# EAGLE schematic freetserv (EAGLE 7.5.0)

## Sheet 1 of 7
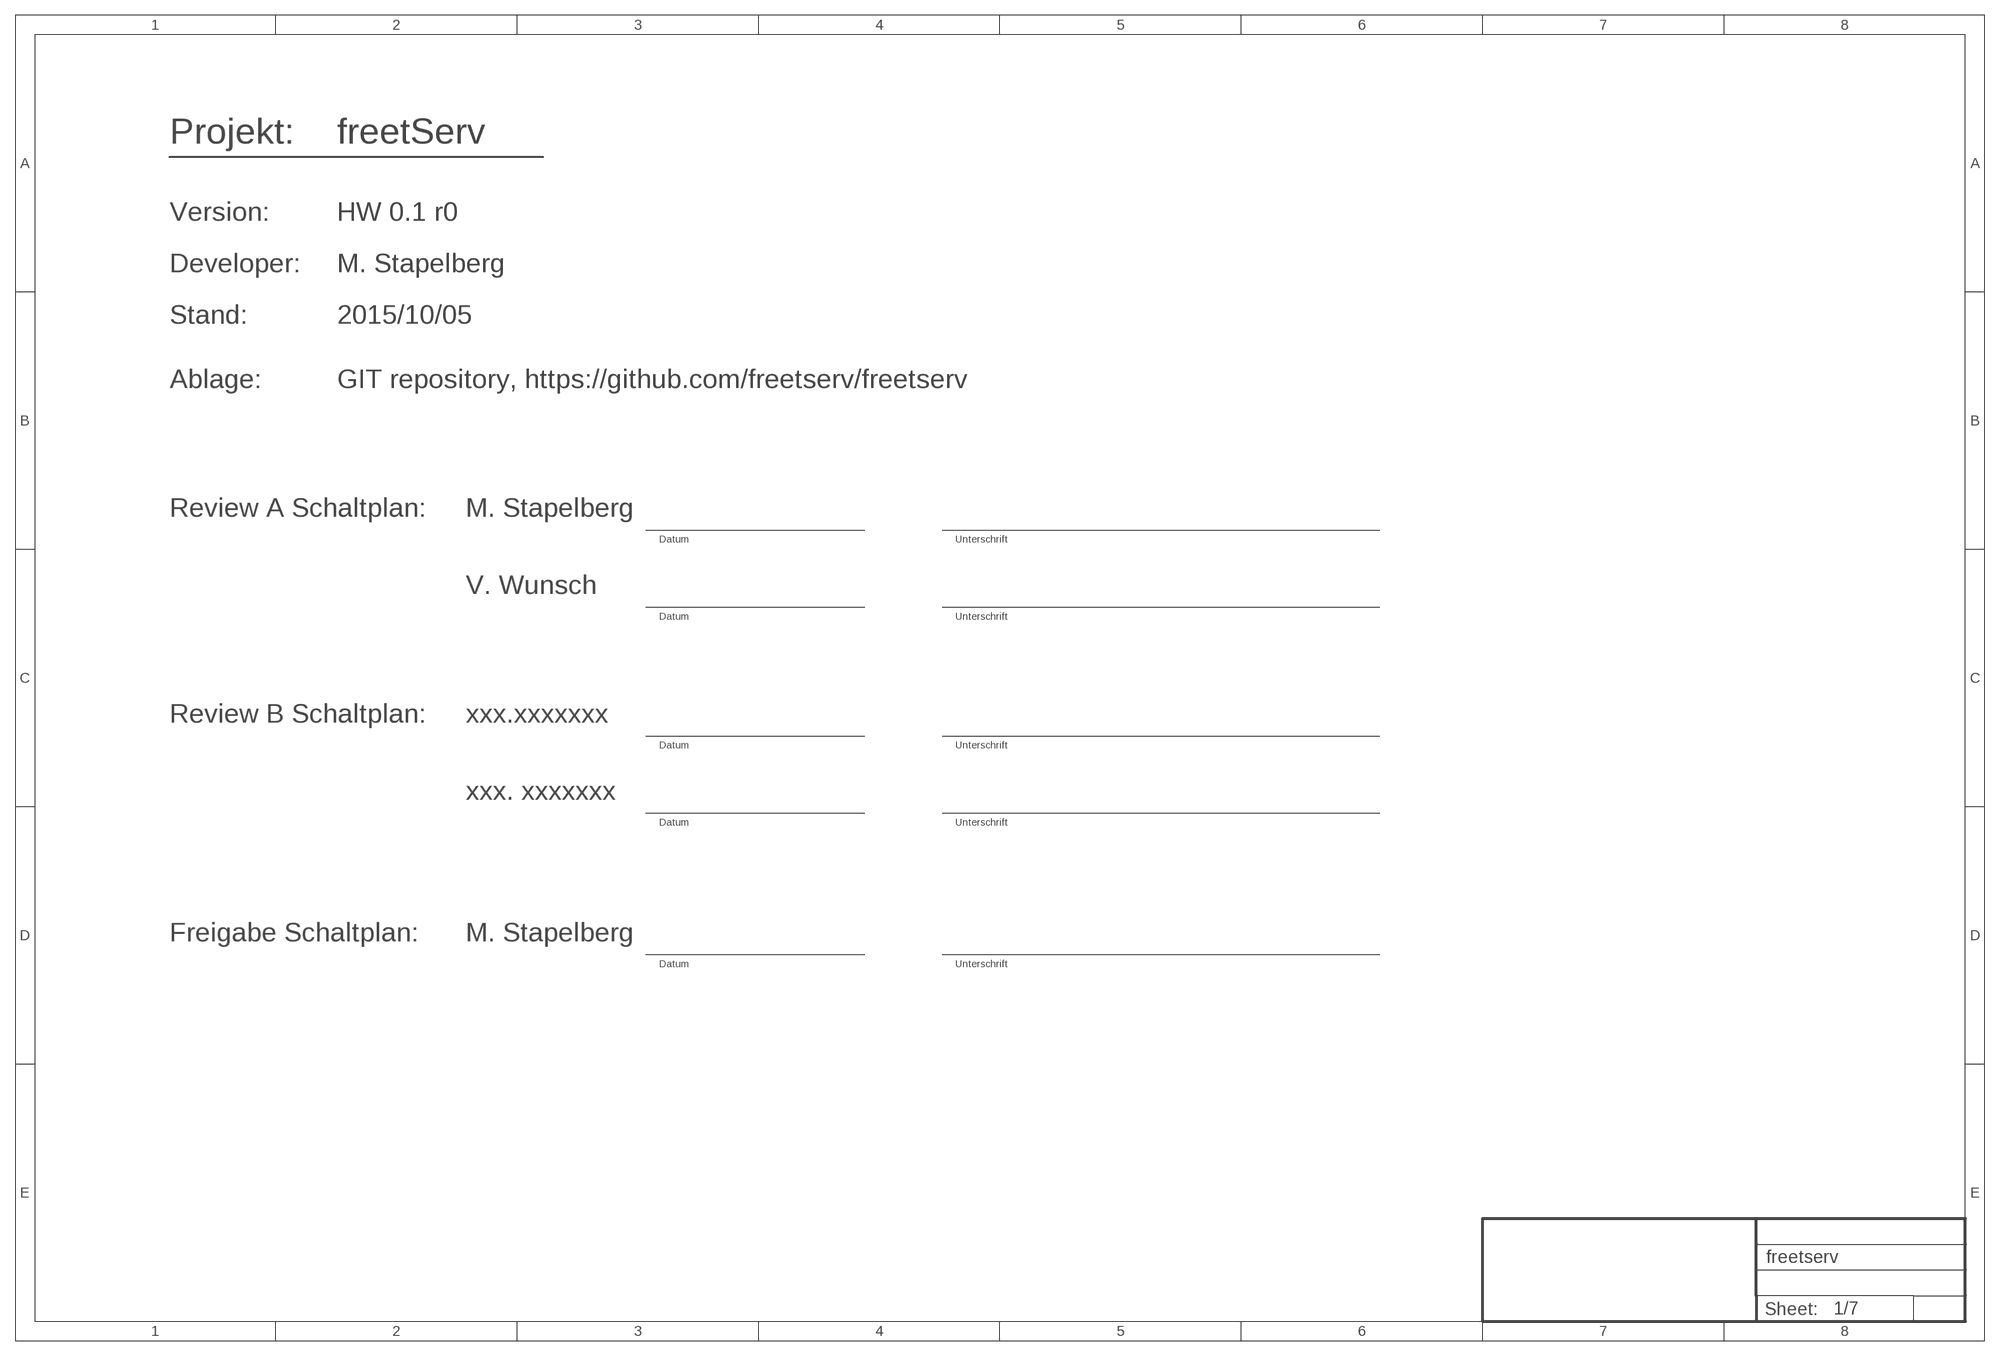
[diagram p0: schematic, sheet 1]

### Notes on the sheet
- Projekt: | freetServ
- Version: | HW 0.1 r0
- Developer: | M. Stapelberg
- Stand: | 2015/10/05
- Ablage: | GIT repository, https://github.com/freetserv/freetserv
- Review A Schaltplan: | M. Stapelberg
- Datum | Unterschrift
- V. Wunsch
- Datum | Unterschrift
- Review B Schaltplan: | xxx.xxxxxxx
- Datum | Unterschrift
- xxx. xxxxxxx
- Datum | Unterschrift
- Freigabe Schaltplan: | M. Stapelberg
- Datum | Unterschrift

## Sheet 2 of 7
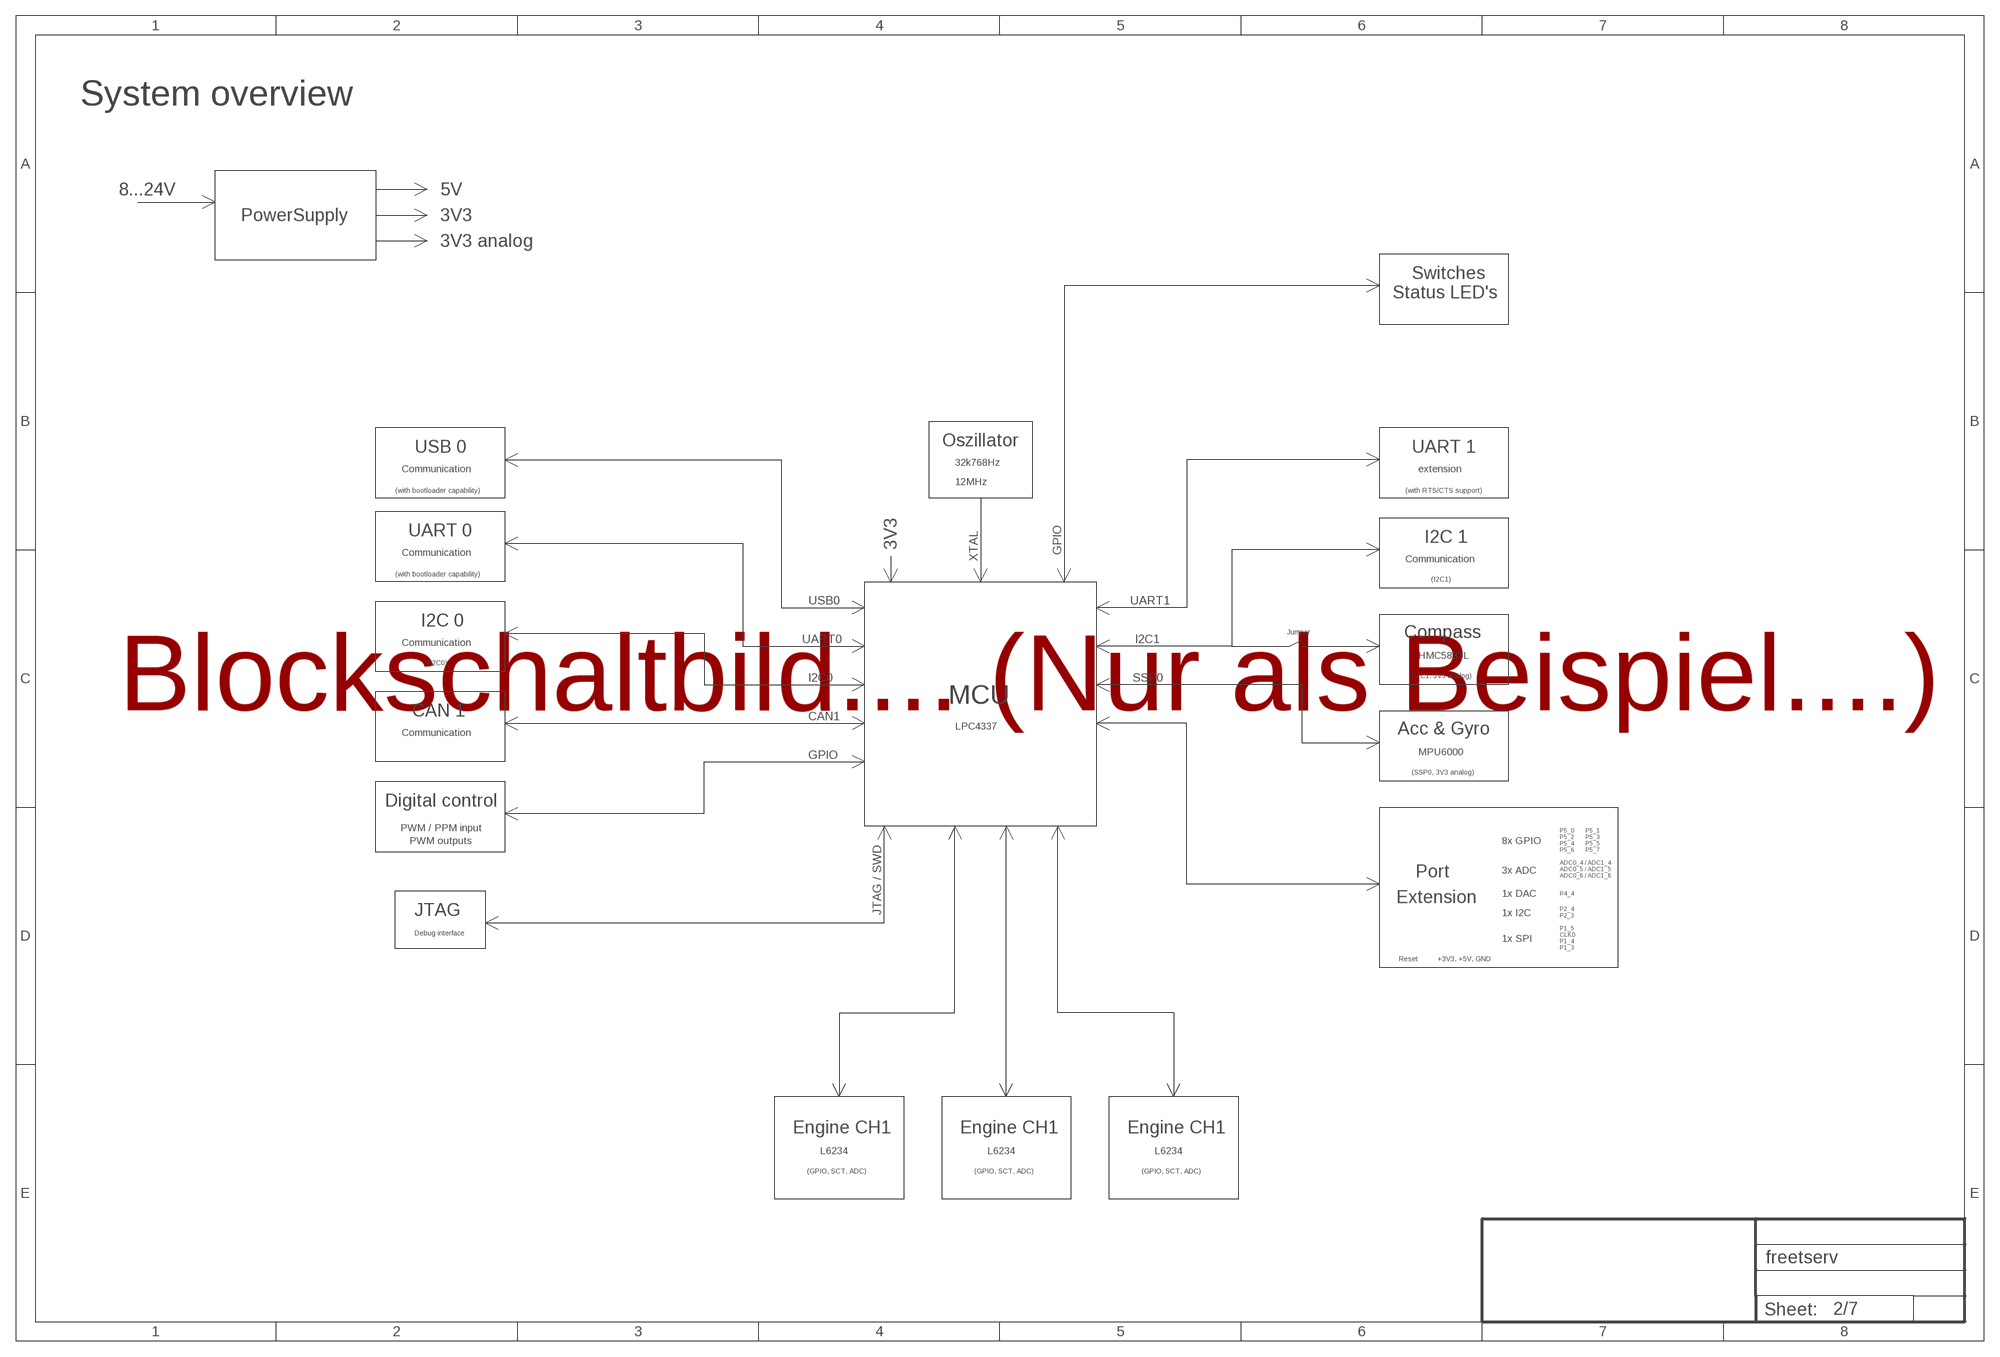
[diagram p1: schematic, sheet 2]

### Notes on the sheet
- System overview
- 8...24V | 5V
- PowerSupply | 3V3
- 3V3 analog
- Switches
- Status LED's
- Oszillator
- USB 0 | UART 1
- 32k768Hz
- Communication | extension
- 12MHz
- (with bootloader capability) | (with RTS/CTS support)
- UART 0
- I2C 1
- 3V3
- Communication | GPIO
- XTAL | Communication
- (with bootloader capability)
- (I2C1)
- USB0 | UART1
- I2C 0
- Jumper
- Compass
- Communication | UART0 | I2C1
- HMC5883L
- (I2C0)
- (I2C1, 3V3 analog)
- I2C0 | SSP0
- Blockschaltbild.... (Nur als Beispiel....) | MCU
- CAN 1
- CAN1
- LPC4337
- Communication | Acc & Gyro
- MPU6000
- GPIO
- (SSP0, 3V3 analog)
- Digital control
- PWM / PPM input | P5_0 | P5_1
- P5_2 | P5_3
- PWM outputs | 8x GPIO | P5_4 | P5_5
- P5_6 | P5_7
- ADC0_4 / ADC1_4
- ADC0_5 / ADC1_5
- 3x ADC
- Port | ADC0_6 / ADC1_6
- 1x DAC | P4_4
- Extension
- P2_4
- JTAG | JTAG / SWD | 1x I2C
- P2_3
- P1_5
- Debug interface | CLK0
- 1x SPI | P1_4
- P1_3
- Reset | +3V3, +5V, GND
- Engine CH1 | Engine CH1 | Engine CH1
- L6234 | L6234 | L6234
- (GPIO, SCT, ADC) | (GPIO, SCT, ADC) | (GPIO, SCT, ADC)

## Sheet 3 of 7
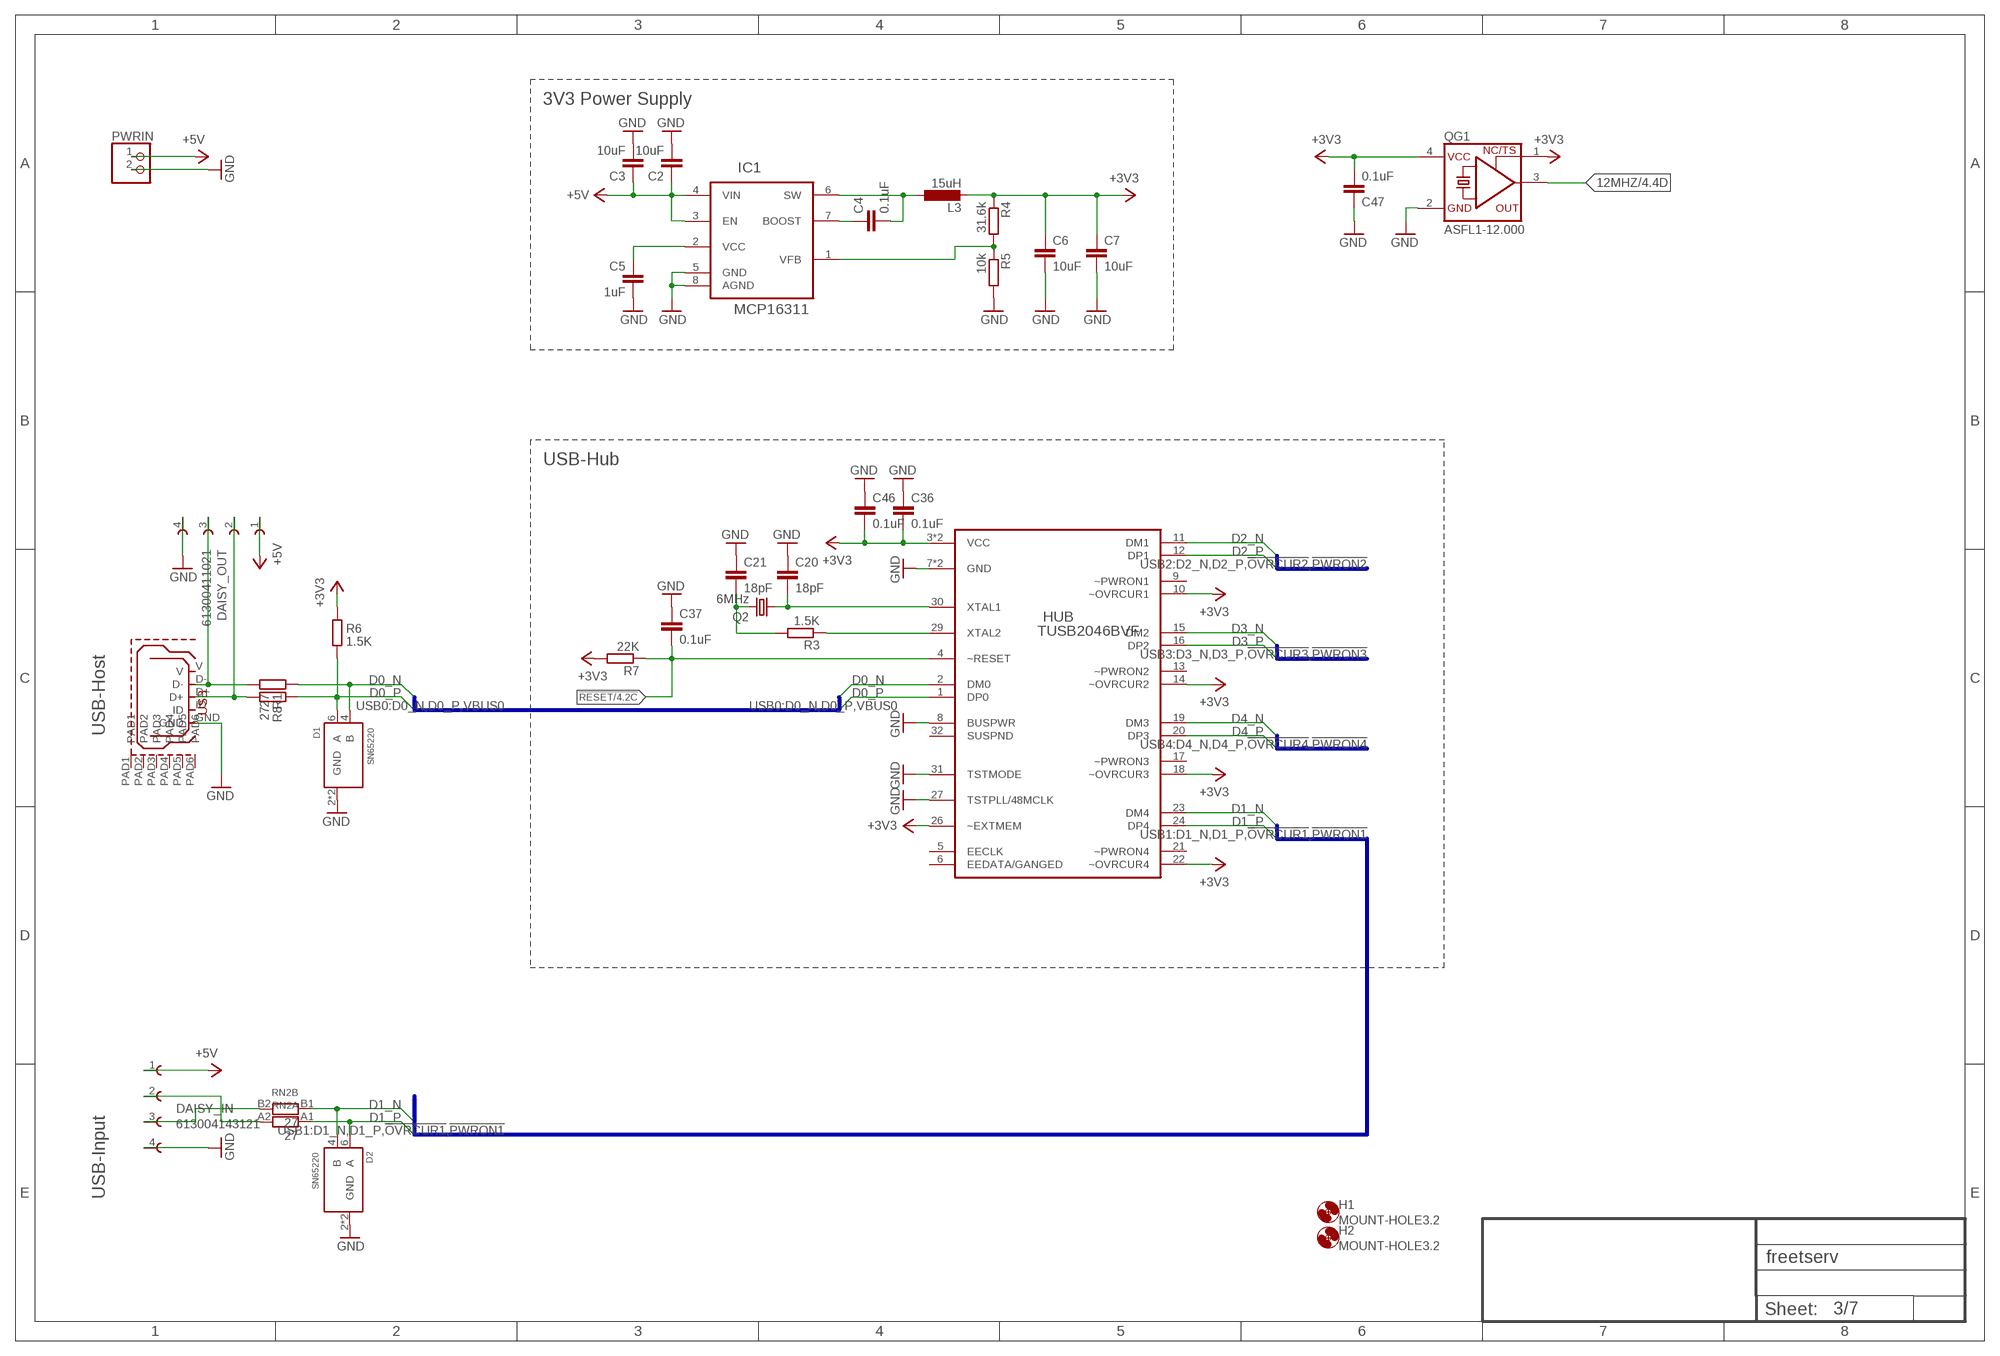
[diagram p2: schematic, sheet 3]

### Parts
C2  10uF  C-EUC0805  [C0805]
C3  10uF  C-EUC0805  [C0805]
C4  0.1uF  C-EUC0805  [C0805]
C5  1uF  C-EUC0805  [C0805]
C6  10uF  C-EUC0805  [C0805]
C7  10uF  C-EUC0805  [C0805]
C20  18pF  C-EUC0805  [C0805]
C21  18pF  C-EUC0805  [C0805]
C36  0.1uF  C-EUC0805  [C0805]
C37  0.1uF  C-EUC0805  [C0805]
C46  0.1uF  C-EUC0805  [C0805]
C47  0.1uF  C-EUC0805  [C0805]
D1  SN65220  [SOT23-6]
D2  SN65220  [SOT23-6]
DAISY_IN  613004143121  [613004143121]
DAISY_OUT  61300411021  [61300411021]
H1  MOUNT-HOLE3.2  [3,2]
H2  MOUNT-HOLE3.2  [3,2]
HUB  TUSB2046BVF  [QFP80P900X900X145-32N]
IC1  MCP16311  MCP16311-E/MS  [MSOP8]
L3  15uH  NR6028T220M  [NR60XX]
PWRIN  PINHD-1X2  [1X02]
Q2  6MHz  CSM-7X-DU  [CSM-7X-DU]
QG1  ASFL1-12.000  XO-XO53  [XO53]
R1  27  R-EU_R0805  [R0805]
R3  1.5K  R-EU_R0805  [R0805]
R4  31.6k  R-EU_R0805  [R0805]
R5  10k  R-EU_R0805  [R0805]
R6  1.5K  R-EU_R0805  [R0805]
R7  22K  R-EU_R0805  [R0805]
R8  27  R-EU_R0805  [R0805]
RN2  27  EXBV4V  [EXBV4V]
USB_HOST  USB_MICROB  [USB_MICROB_PACKAGE]

### Nets
12MHZ: QG1.3(OUT) ; also sheet 4,5,6
!RESET: C37.2 HUB.4(~RESET) R7.1 ; also sheet 4,5,6
+3V3 [power]: C6.1 C7.1 C36.2 C46.2 C47.2 HUB.3(VCC) HUB.10(~OVRCUR1) HUB.14(~OVRCUR2) HUB.18(~OVRCUR3) HUB.22(~OVRCUR4) HUB.25(VCC) HUB.26(~EXTMEM) L3.2 QG1.1(TS) QG1.4(VCC) R4.1 R6.1 R7.2 ; also sheet 4,5,6
+5V [power]: C2.1 C3.1 DAISY_IN.1 DAISY_OUT.1 IC1.3(EN) IC1.4(VIN) PWRIN.1
D0_N [USB]: D1.4(B) HUB.2(DM0) R1.1
D0_P [USB]: D1.6(A) HUB.1(DP0) R6.2 R8.1
D1_N [USB]: D2.4(B) HUB.23(DM4) RN2.B1
D1_P [USB]: D2.6(A) HUB.24(DP4) RN2.A1
D2_N [USB]: HUB.11(DM1) ; also sheet 4
D2_P [USB]: HUB.12(DP1) ; also sheet 4
D3_N [USB]: HUB.15(DM2) ; also sheet 5
D3_P [USB]: HUB.16(DP2) ; also sheet 5
D4_N [USB]: HUB.19(DM3) ; also sheet 6
D4_P [USB]: HUB.20(DP3) ; also sheet 6
DX0_N [USB]: DAISY_OUT.3 R1.2 USB_HOST.D-
DX0_P [USB]: DAISY_OUT.2 R8.2 USB_HOST.D+
GND: C2.2 C3.2 C5.2 C6.2 C7.2 C20.1 C21.1 C36.1 C37.1 C46.1 C47.1 D1.2(GND) D1.5(GND) D2.2(GND) D2.5(GND) DAISY_IN.4 DAISY_OUT.4 HUB.7(GND) HUB.8(BUSPWR) HUB.27(TSTPLL/48MCLK) HUB.28(GND) HUB.31(TSTMODE) IC1.5(GND) IC1.8(AGND) PWRIN.2 QG1.2(GND) R5.2 USB_HOST.GND ; also sheet 4,5,6
N$3: C4.1 IC1.7(BOOST)
N$4: C4.2 IC1.6(SW) L3.1
N$6: IC1.1(VFB) R4.2 R5.1
N$7: DAISY_IN.2 RN2.A2
N$8: DAISY_IN.3 RN2.B2
N$10: C5.1 IC1.2(VCC)
N$37: HUB.29(XTAL2) R3.1
N$44: C20.2 HUB.30(XTAL1) Q2.1
N$45: C21.2 Q2.2 R3.2
Unconnected: HUB.5(EECLK) HUB.6(EEDATA/GANGED) HUB.9(~PWRON1) HUB.13(~PWRON2) HUB.17(~PWRON3) HUB.21(~PWRON4) HUB.32(SUSPND) USB_HOST.ID USB_HOST.PAD1 USB_HOST.PAD2 USB_HOST.PAD3 USB_HOST.PAD4 USB_HOST.PAD5 USB_HOST.PAD6 USB_HOST.V

### Buses
USB1:D1_N,D1_P,!OVRCUR1,!PWRON1
USB2:D2_N,D2_P,!OVRCUR2,!PWRON2
USB3:D3_N,D3_P,!OVRCUR3,!PWRON3
USB4:D4_N,D4_P,!OVRCUR4,!PWRON4
USB0:D0_N,D0_P,VBUS0

### Notes on the sheet
- 3V3 Power Supply
- USB-Hub
- USB-Host
- USB-Input

## Sheet 4 of 7
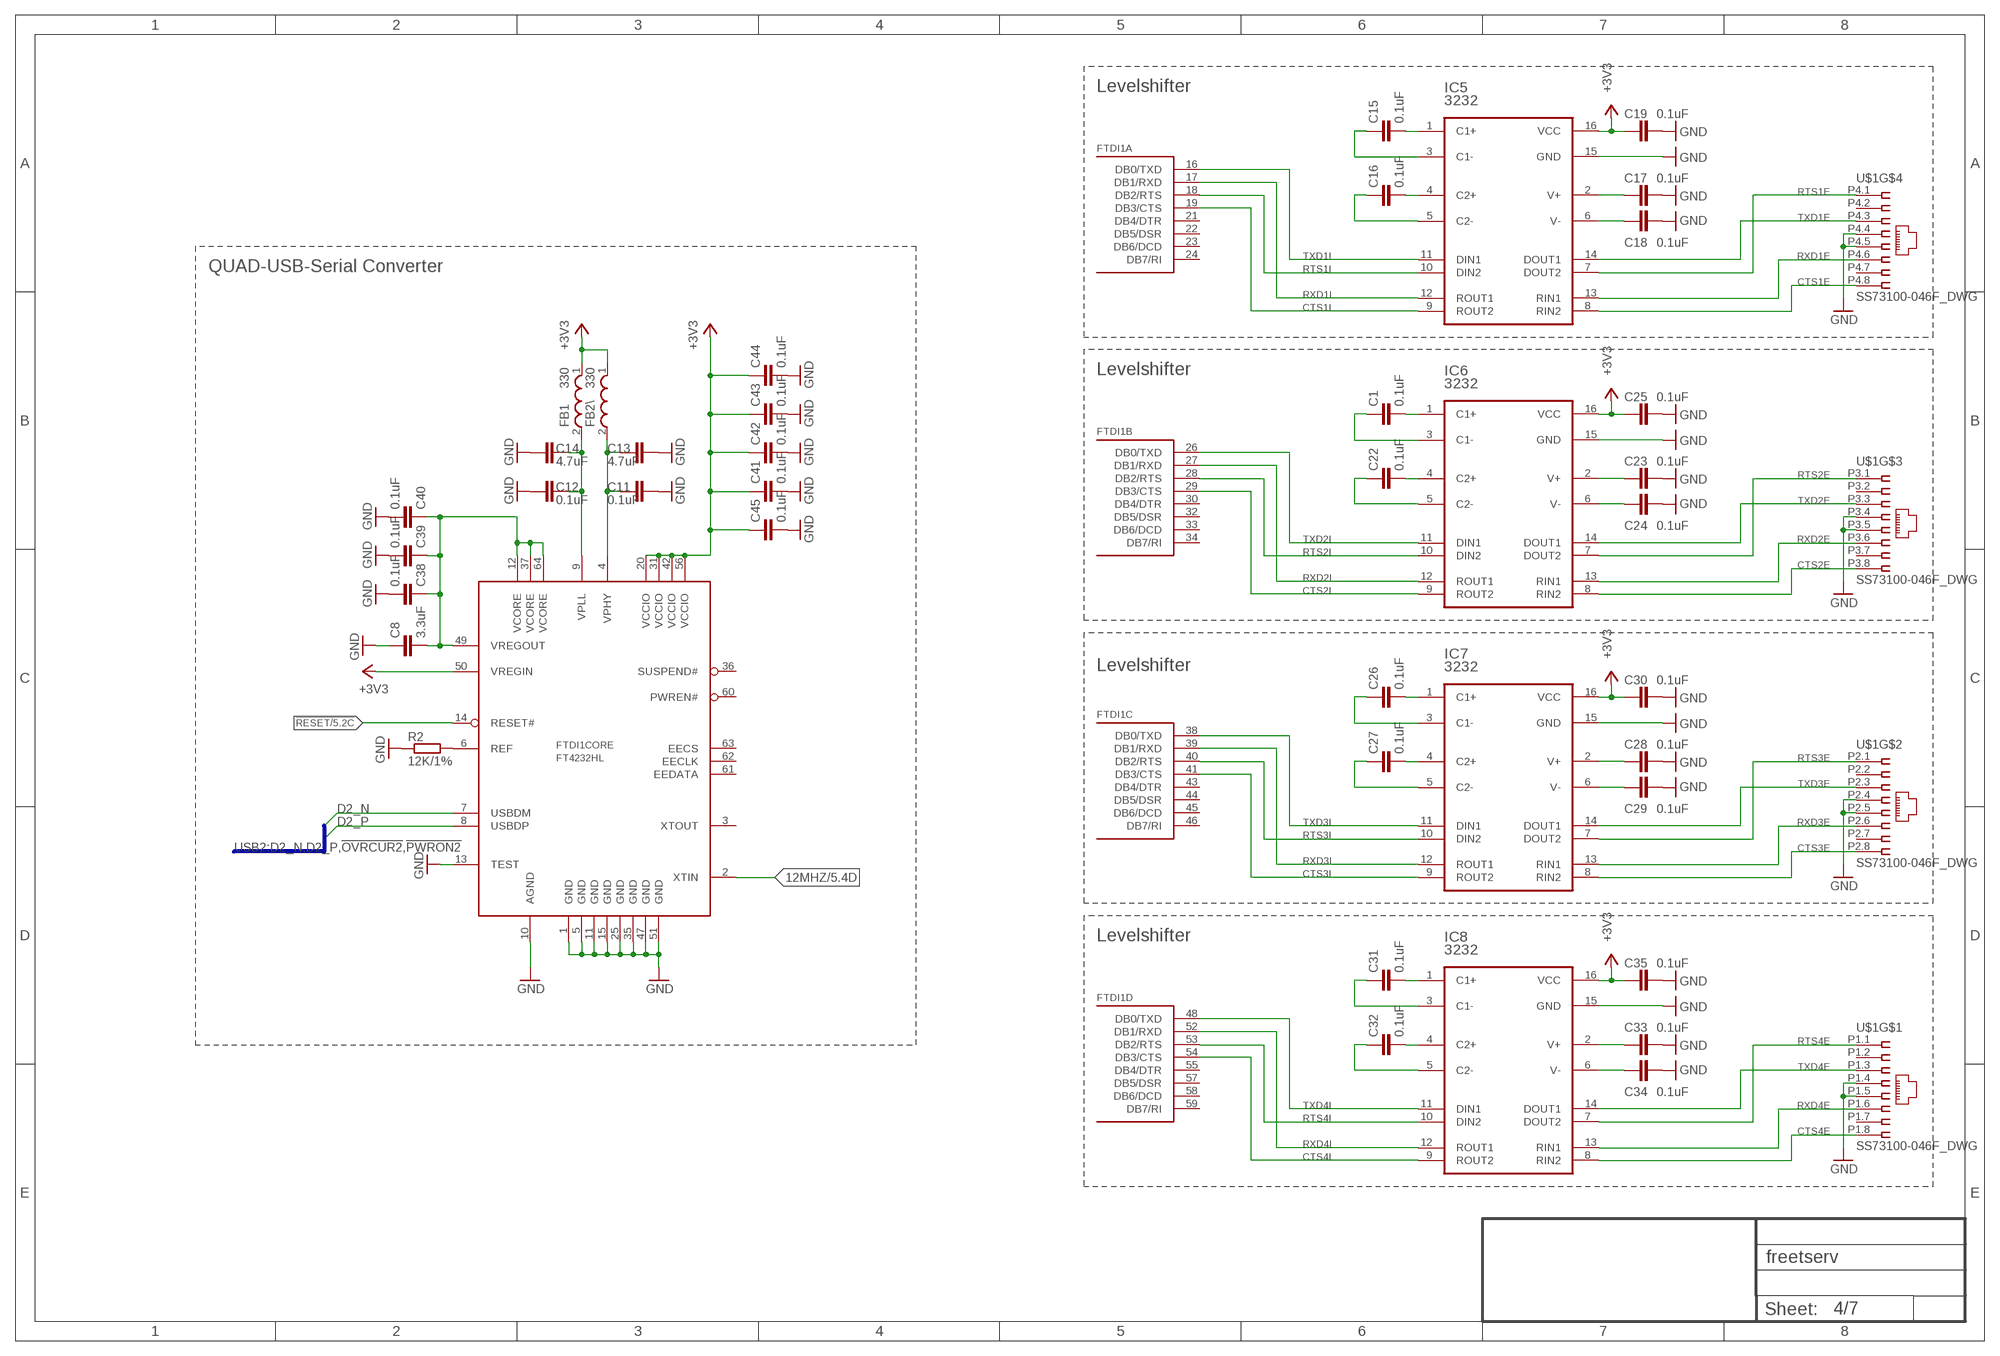
[diagram p3: schematic, sheet 4]

### Parts
C1  0.1uF  C-EUC0805  [C0805]
C8  3.3uF  C-EUC0805  [C0805]
C11  0.1uF  C-EUC0805  [C0805]
C12  0.1uF  C-EUC0805  [C0805]
C13  4.7uF  C-EUC0805  [C0805]
C14  4.7uF  C-EUC0805  [C0805]
C15  0.1uF  C-EUC0805  [C0805]
C16  0.1uF  C-EUC0805  [C0805]
C17  0.1uF  C-EUC0805  [C0805]
C18  0.1uF  C-EUC0805  [C0805]
C19  0.1uF  C-EUC0805  [C0805]
C22  0.1uF  C-EUC0805  [C0805]
C23  0.1uF  C-EUC0805  [C0805]
C24  0.1uF  C-EUC0805  [C0805]
C25  0.1uF  C-EUC0805  [C0805]
C26  0.1uF  C-EUC0805  [C0805]
C27  0.1uF  C-EUC0805  [C0805]
C28  0.1uF  C-EUC0805  [C0805]
C29  0.1uF  C-EUC0805  [C0805]
C30  0.1uF  C-EUC0805  [C0805]
C31  0.1uF  C-EUC0805  [C0805]
C32  0.1uF  C-EUC0805  [C0805]
C33  0.1uF  C-EUC0805  [C0805]
C34  0.1uF  C-EUC0805  [C0805]
C35  0.1uF  C-EUC0805  [C0805]
C38  0.1uF  C-EUC0805  [C0805]
C39  0.1uF  C-EUC0805  [C0805]
C40  0.1uF  C-EUC0805  [C0805]
C41  0.1uF  C-EUC0805  [C0805]
C42  0.1uF  C-EUC0805  [C0805]
C43  0.1uF  C-EUC0805  [C0805]
C44  0.1uF  C-EUC0805  [C0805]
C45  0.1uF  C-EUC0805  [C0805]
FB1  330  WE-KI_0805A  [WE-KI_0805A]
FB2\  330  WE-KI_0805A  [WE-KI_0805A]
FTDI1  FT4232HL  [LQFP64]
IC5  3232  MAX3232ECPW  [SOP65P640X120-16N]
IC6  3232  MAX3232ECPW  [SOP65P640X120-16N]
IC7  3232  MAX3232ECPW  [SOP65P640X120-16N]
IC8  3232  MAX3232ECPW  [SOP65P640X120-16N]
R2  12K/1%  R-EU_R0805  [R0805]
U$1  SS73100-046F_DWG  [SS73100-046F]

### Nets
12MHZ: FTDI1.2(CORE:XTIN) ; also sheet 3,5,6
!RESET: FTDI1.14(CORE:RESET#) ; also sheet 3,5,6
+1V8-1: C8.2 C38.1 C39.1 C40.1 FTDI1.12(CORE:VCORE) FTDI1.37(CORE:VCORE) FTDI1.49(CORE:VREGOUT) FTDI1.64(CORE:VCORE)
+3V3 [power]: C19.2 C25.2 C30.2 C35.2 C41.1 C42.1 C43.1 C44.1 C45.1 FB1.1 FB2\.1 FTDI1.20(CORE:VCCIO) FTDI1.31(CORE:VCCIO) FTDI1.42(CORE:VCCIO) FTDI1.50(CORE:VREGIN) FTDI1.56(CORE:VCCIO) IC5.16(VCC) IC6.16(VCC) IC7.16(VCC) IC8.16(VCC) ; also sheet 3,5,6
CTS1E: IC5.8(RIN2) U$1.P4.8
CTS1I: FTDI1.19(A:DB3/CTS) IC5.9(ROUT2)
CTS2E: IC6.8(RIN2) U$1.P3.8
CTS2I: FTDI1.29(B:DB3/CTS) IC6.9(ROUT2)
CTS3E: IC7.8(RIN2) U$1.P2.8
CTS3I: FTDI1.41(C:DB3/CTS) IC7.9(ROUT2)
CTS4E: IC8.8(RIN2) U$1.P1.8
CTS4I: FTDI1.54(D:DB3/CTS) IC8.9(ROUT2)
D2_N [USB]: FTDI1.7(CORE:USBDM) ; also sheet 3
D2_P [USB]: FTDI1.8(CORE:USBDP) ; also sheet 3
GND: C8.1 C11.2 C12.2 C13.2 C14.2 C17.1 C18.1 C19.1 C23.1 C24.1 C25.1 C28.1 C29.1 C30.1 C33.1 C34.1 C35.1 C38.2 C39.2 C40.2 C41.2 C42.2 C43.2 C44.2 C45.2 FTDI1.1(CORE:GND) FTDI1.5(CORE:GND) FTDI1.10(CORE:AGND) FTDI1.11(CORE:GND) FTDI1.13(CORE:TEST) FTDI1.15(CORE:GND) FTDI1.25(CORE:GND) FTDI1.35(CORE:GND) FTDI1.47(CORE:GND) FTDI1.51(CORE:GND) IC5.15(GND) IC6.15(GND) IC7.15(GND) IC8.15(GND) R2.1 U$1.P1.4 U$1.P1.5 U$1.P2.4 U$1.P2.5 U$1.P3.4 U$1.P3.5 U$1.P4.4 U$1.P4.5 ; also sheet 3,5,6
N$1: C1.2 IC6.1(C1+)
N$2: C1.1 IC6.3(C1-)
N$11: C22.2 IC6.4(C2+)
N$12: C22.1 IC6.5(C2-)
N$14: FTDI1.6(CORE:REF) R2.2
N$17: C11.1 C13.1 FB2\.2 FTDI1.4(CORE:VPHY)
N$18: C12.1 C14.1 FB1.2 FTDI1.9(CORE:VPLL)
N$21: C23.2 IC6.2(V+)
N$22: C24.2 IC6.6(V-)
N$31: C15.2 IC5.1(C1+)
N$32: C15.1 IC5.3(C1-)
N$33: C16.2 IC5.4(C2+)
N$34: C16.1 IC5.5(C2-)
N$39: C17.2 IC5.2(V+)
N$40: C18.2 IC5.6(V-)
N$46: C26.2 IC7.1(C1+)
N$47: C26.1 IC7.3(C1-)
N$48: C27.2 IC7.4(C2+)
N$49: C27.1 IC7.5(C2-)
N$52: C28.2 IC7.2(V+)
N$53: C29.2 IC7.6(V-)
N$60: C31.2 IC8.1(C1+)
N$61: C31.1 IC8.3(C1-)
N$62: C32.2 IC8.4(C2+)
N$63: C32.1 IC8.5(C2-)
N$66: C33.2 IC8.2(V+)
N$67: C34.2 IC8.6(V-)
RTS1E: IC5.7(DOUT2) U$1.P4.1
RTS1I: FTDI1.18(A:DB2/RTS) IC5.10(DIN2)
RTS2E: IC6.7(DOUT2) U$1.P3.1
RTS2I: FTDI1.28(B:DB2/RTS) IC6.10(DIN2)
RTS3E: IC7.7(DOUT2) U$1.P2.1
RTS3I: FTDI1.40(C:DB2/RTS) IC7.10(DIN2)
RTS4E: IC8.7(DOUT2) U$1.P1.1
RTS4I: FTDI1.53(D:DB2/RTS) IC8.10(DIN2)
RXD1E: IC5.13(RIN1) U$1.P4.6
RXD1I: FTDI1.17(A:DB1/RXD) IC5.12(ROUT1)
RXD2E: IC6.13(RIN1) U$1.P3.6
RXD2I: FTDI1.27(B:DB1/RXD) IC6.12(ROUT1)
RXD3E: IC7.13(RIN1) U$1.P2.6
RXD3I: FTDI1.39(C:DB1/RXD) IC7.12(ROUT1)
RXD4E: IC8.13(RIN1) U$1.P1.6
RXD4I: FTDI1.52(D:DB1/RXD) IC8.12(ROUT1)
TXD1E: IC5.14(DOUT1) U$1.P4.3
TXD1I: FTDI1.16(A:DB0/TXD) IC5.11(DIN1)
TXD2E: IC6.14(DOUT1) U$1.P3.3
TXD2I: FTDI1.26(B:DB0/TXD) IC6.11(DIN1)
TXD3E: IC7.14(DOUT1) U$1.P2.3
TXD3I: FTDI1.38(C:DB0/TXD) IC7.11(DIN1)
TXD4E: IC8.14(DOUT1) U$1.P1.3
TXD4I: FTDI1.48(D:DB0/TXD) IC8.11(DIN1)
Unconnected: FTDI1.3(CORE:XTOUT) FTDI1.21(A:DB4/DTR) FTDI1.22(A:DB5/DSR) FTDI1.23(A:DB6/DCD) FTDI1.24(A:DB7/RI) FTDI1.30(B:DB4/DTR) FTDI1.32(B:DB5/DSR) FTDI1.33(B:DB6/DCD) FTDI1.34(B:DB7/RI) FTDI1.36(CORE:SUSPEND#) FTDI1.43(C:DB4/DTR) FTDI1.44(C:DB5/DSR) FTDI1.45(C:DB6/DCD) FTDI1.46(C:DB7/RI) FTDI1.55(D:DB4/DTR) FTDI1.57(D:DB5/DSR) FTDI1.58(D:DB6/DCD) FTDI1.59(D:DB7/RI) FTDI1.60(CORE:PWREN#) FTDI1.61(CORE:EEDATA) FTDI1.62(CORE:EECLK) FTDI1.63(CORE:EECS) U$1.H1 U$1.H2 U$1.H3 U$1.H4 U$1.H5 U$1.H6 U$1.H7 U$1.H8 U$1.H9 U$1.P1.2 U$1.P1.7 U$1.P2.2 U$1.P2.7 U$1.P3.2 U$1.P3.7 U$1.P4.2 U$1.P4.7

### Buses
USB2:D2_N,D2_P,!OVRCUR2,!PWRON2

### Notes on the sheet
- Levelshifter
- QUAD-USB-Serial Converter
- Levelshifter
- Levelshifter
- Levelshifter

## Sheet 5 of 7
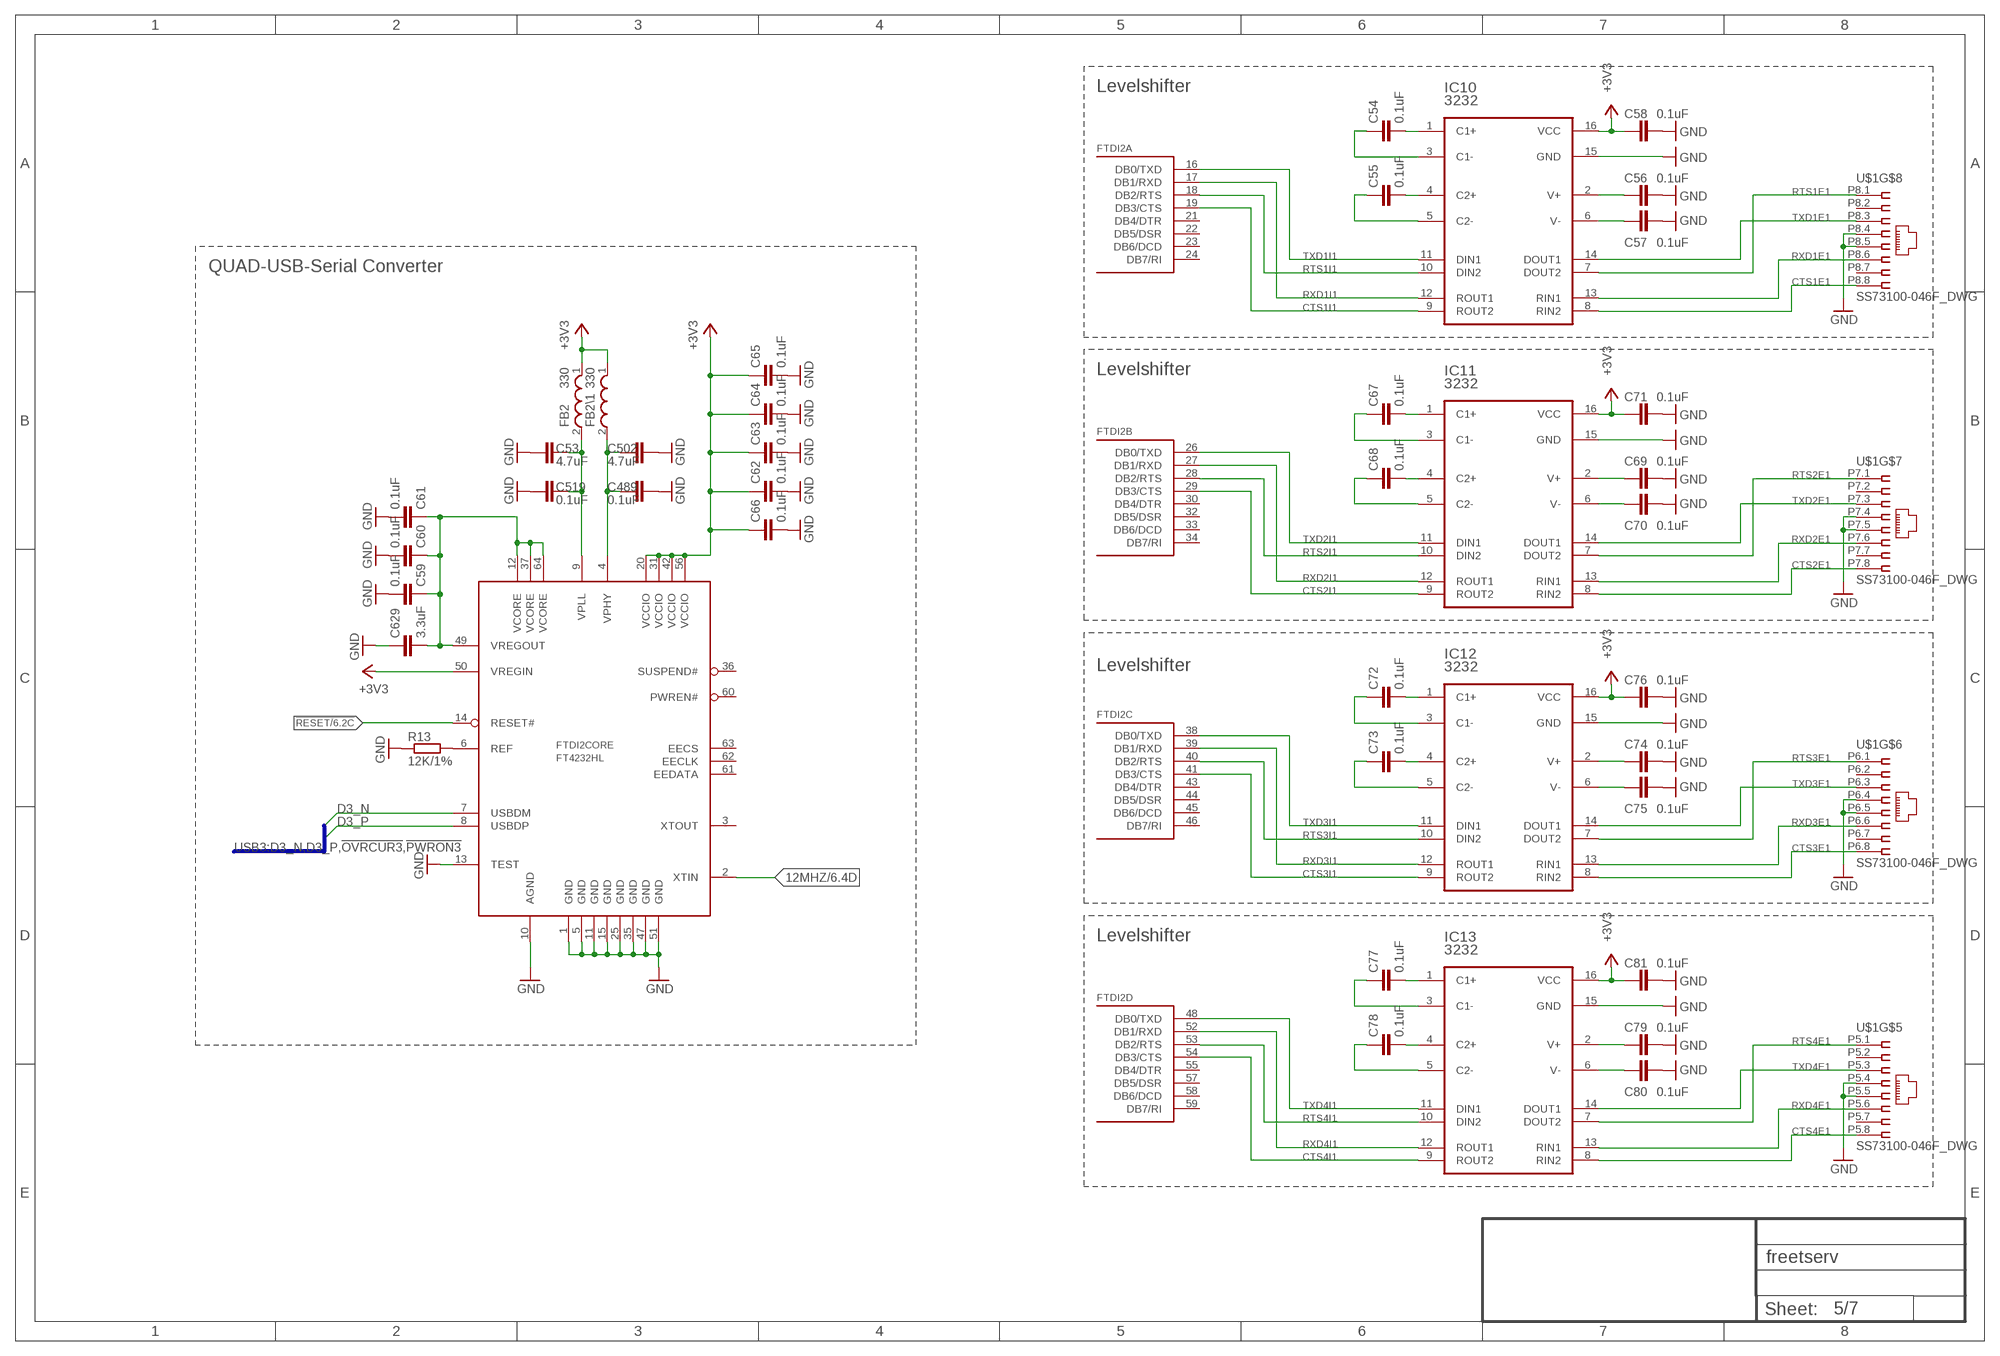
[diagram p4: schematic, sheet 5]

### Parts
C53  4.7uF  C-EUC0805  [C0805]
C54  0.1uF  C-EUC0805  [C0805]
C55  0.1uF  C-EUC0805  [C0805]
C56  0.1uF  C-EUC0805  [C0805]
C57  0.1uF  C-EUC0805  [C0805]
C58  0.1uF  C-EUC0805  [C0805]
C59  0.1uF  C-EUC0805  [C0805]
C60  0.1uF  C-EUC0805  [C0805]
C61  0.1uF  C-EUC0805  [C0805]
C62  0.1uF  C-EUC0805  [C0805]
C63  0.1uF  C-EUC0805  [C0805]
C64  0.1uF  C-EUC0805  [C0805]
C65  0.1uF  C-EUC0805  [C0805]
C66  0.1uF  C-EUC0805  [C0805]
C67  0.1uF  C-EUC0805  [C0805]
C68  0.1uF  C-EUC0805  [C0805]
C69  0.1uF  C-EUC0805  [C0805]
C70  0.1uF  C-EUC0805  [C0805]
C71  0.1uF  C-EUC0805  [C0805]
C72  0.1uF  C-EUC0805  [C0805]
C73  0.1uF  C-EUC0805  [C0805]
C74  0.1uF  C-EUC0805  [C0805]
C75  0.1uF  C-EUC0805  [C0805]
C76  0.1uF  C-EUC0805  [C0805]
C77  0.1uF  C-EUC0805  [C0805]
C78  0.1uF  C-EUC0805  [C0805]
C79  0.1uF  C-EUC0805  [C0805]
C80  0.1uF  C-EUC0805  [C0805]
C81  0.1uF  C-EUC0805  [C0805]
C489  0.1uF  C-EUC0805  [C0805]
C502  4.7uF  C-EUC0805  [C0805]
C519  0.1uF  C-EUC0805  [C0805]
C629  3.3uF  C-EUC0805  [C0805]
FB2  330  WE-KI_0805A  [WE-KI_0805A]
FB2\1  330  WE-KI_0805A  [WE-KI_0805A]
FTDI2  FT4232HL  [LQFP64]
IC10  3232  MAX3232ECPW  [SOP65P640X120-16N]
IC11  3232  MAX3232ECPW  [SOP65P640X120-16N]
IC12  3232  MAX3232ECPW  [SOP65P640X120-16N]
IC13  3232  MAX3232ECPW  [SOP65P640X120-16N]
R13  12K/1%  R-EU_R0805  [R0805]

### Nets
12MHZ: FTDI2.2(CORE:XTIN) ; also sheet 3,4,6
!RESET: FTDI2.14(CORE:RESET#) ; also sheet 3,4,6
+1V8-2: C59.1 C60.1 C61.1 C629.2 FTDI2.12(CORE:VCORE) FTDI2.37(CORE:VCORE) FTDI2.49(CORE:VREGOUT) FTDI2.64(CORE:VCORE)
+3V3 [power]: C58.2 C62.1 C63.1 C64.1 C65.1 C66.1 C71.2 C76.2 C81.2 FB2.1 FB2\1.1 FTDI2.20(CORE:VCCIO) FTDI2.31(CORE:VCCIO) FTDI2.42(CORE:VCCIO) FTDI2.50(CORE:VREGIN) FTDI2.56(CORE:VCCIO) IC10.16(VCC) IC11.16(VCC) IC12.16(VCC) IC13.16(VCC) ; also sheet 3,4,6
CTS1E1: IC10.8(RIN2) U$1.P8.8
CTS1I1: FTDI2.19(A:DB3/CTS) IC10.9(ROUT2)
CTS2E1: IC11.8(RIN2) U$1.P7.8
CTS2I1: FTDI2.29(B:DB3/CTS) IC11.9(ROUT2)
CTS3E1: IC12.8(RIN2) U$1.P6.8
CTS3I1: FTDI2.41(C:DB3/CTS) IC12.9(ROUT2)
CTS4E1: IC13.8(RIN2) U$1.P5.8
CTS4I1: FTDI2.54(D:DB3/CTS) IC13.9(ROUT2)
D3_N [USB]: FTDI2.7(CORE:USBDM) ; also sheet 3
D3_P [USB]: FTDI2.8(CORE:USBDP) ; also sheet 3
GND: C53.2 C56.1 C57.1 C58.1 C59.2 C60.2 C61.2 C62.2 C63.2 C64.2 C65.2 C66.2 C69.1 C70.1 C71.1 C74.1 C75.1 C76.1 C79.1 C80.1 C81.1 C489.2 C502.2 C519.2 C629.1 FTDI2.1(CORE:GND) FTDI2.5(CORE:GND) FTDI2.10(CORE:AGND) FTDI2.11(CORE:GND) FTDI2.13(CORE:TEST) FTDI2.15(CORE:GND) FTDI2.25(CORE:GND) FTDI2.35(CORE:GND) FTDI2.47(CORE:GND) FTDI2.51(CORE:GND) IC10.15(GND) IC11.15(GND) IC12.15(GND) IC13.15(GND) R13.1 U$1.P5.4 U$1.P5.5 U$1.P6.4 U$1.P6.5 U$1.P7.4 U$1.P7.5 U$1.P8.4 U$1.P8.5 ; also sheet 3,4,6
N$5: FTDI2.6(CORE:REF) R13.2
N$19: C54.2 IC10.1(C1+)
N$20: C54.1 IC10.3(C1-)
N$23: C55.2 IC10.4(C2+)
N$24: C55.1 IC10.5(C2-)
N$25: C56.2 IC10.2(V+)
N$26: C57.2 IC10.6(V-)
N$27: C67.2 IC11.1(C1+)
N$28: C67.1 IC11.3(C1-)
N$29: C68.2 IC11.4(C2+)
N$30: C68.1 IC11.5(C2-)
N$35: C69.2 IC11.2(V+)
N$36: C70.2 IC11.6(V-)
N$38: C72.2 IC12.1(C1+)
N$41: C72.1 IC12.3(C1-)
N$42: C73.2 IC12.4(C2+)
N$43: C73.1 IC12.5(C2-)
N$50: C74.2 IC12.2(V+)
N$51: C75.2 IC12.6(V-)
N$55: C77.1 IC13.3(C1-)
N$56: C78.2 IC13.4(C2+)
N$57: C78.1 IC13.5(C2-)
N$58: C79.2 IC13.2(V+)
N$59: C80.2 IC13.6(V-)
N$555: C489.1 C502.1 FB2\1.2 FTDI2.4(CORE:VPHY)
N$1355: C53.1 C519.1 FB2.2 FTDI2.9(CORE:VPLL)
N$5499: C77.2 IC13.1(C1+)
RTS1E1: IC10.7(DOUT2) U$1.P8.1
RTS1I1: FTDI2.18(A:DB2/RTS) IC10.10(DIN2)
RTS2E1: IC11.7(DOUT2) U$1.P7.1
RTS2I1: FTDI2.28(B:DB2/RTS) IC11.10(DIN2)
RTS3E1: IC12.7(DOUT2) U$1.P6.1
RTS3I1: FTDI2.40(C:DB2/RTS) IC12.10(DIN2)
RTS4E1: IC13.7(DOUT2) U$1.P5.1
RTS4I1: FTDI2.53(D:DB2/RTS) IC13.10(DIN2)
RXD1E1: IC10.13(RIN1) U$1.P8.6
RXD1I1: FTDI2.17(A:DB1/RXD) IC10.12(ROUT1)
RXD2E1: IC11.13(RIN1) U$1.P7.6
RXD2I1: FTDI2.27(B:DB1/RXD) IC11.12(ROUT1)
RXD3E1: IC12.13(RIN1) U$1.P6.6
RXD3I1: FTDI2.39(C:DB1/RXD) IC12.12(ROUT1)
RXD4E1: IC13.13(RIN1) U$1.P5.6
RXD4I1: FTDI2.52(D:DB1/RXD) IC13.12(ROUT1)
TXD1E1: IC10.14(DOUT1) U$1.P8.3
TXD1I1: FTDI2.16(A:DB0/TXD) IC10.11(DIN1)
TXD2E1: IC11.14(DOUT1) U$1.P7.3
TXD2I1: FTDI2.26(B:DB0/TXD) IC11.11(DIN1)
TXD3E1: IC12.14(DOUT1) U$1.P6.3
TXD3I1: FTDI2.38(C:DB0/TXD) IC12.11(DIN1)
TXD4E1: IC13.14(DOUT1) U$1.P5.3
TXD4I1: FTDI2.48(D:DB0/TXD) IC13.11(DIN1)
Unconnected: FTDI2.3(CORE:XTOUT) FTDI2.21(A:DB4/DTR) FTDI2.22(A:DB5/DSR) FTDI2.23(A:DB6/DCD) FTDI2.24(A:DB7/RI) FTDI2.30(B:DB4/DTR) FTDI2.32(B:DB5/DSR) FTDI2.33(B:DB6/DCD) FTDI2.34(B:DB7/RI) FTDI2.36(CORE:SUSPEND#) FTDI2.43(C:DB4/DTR) FTDI2.44(C:DB5/DSR) FTDI2.45(C:DB6/DCD) FTDI2.46(C:DB7/RI) FTDI2.55(D:DB4/DTR) FTDI2.57(D:DB5/DSR) FTDI2.58(D:DB6/DCD) FTDI2.59(D:DB7/RI) FTDI2.60(CORE:PWREN#) FTDI2.61(CORE:EEDATA) FTDI2.62(CORE:EECLK) FTDI2.63(CORE:EECS) U$1.P5.2 U$1.P5.7 U$1.P6.2 U$1.P6.7 U$1.P7.2 U$1.P7.7 U$1.P8.2 U$1.P8.7

### Buses
USB3:D3_N,D3_P,!OVRCUR3,!PWRON3

### Notes on the sheet
- Levelshifter
- QUAD-USB-Serial Converter
- Levelshifter
- Levelshifter
- Levelshifter

## Sheet 6 of 7
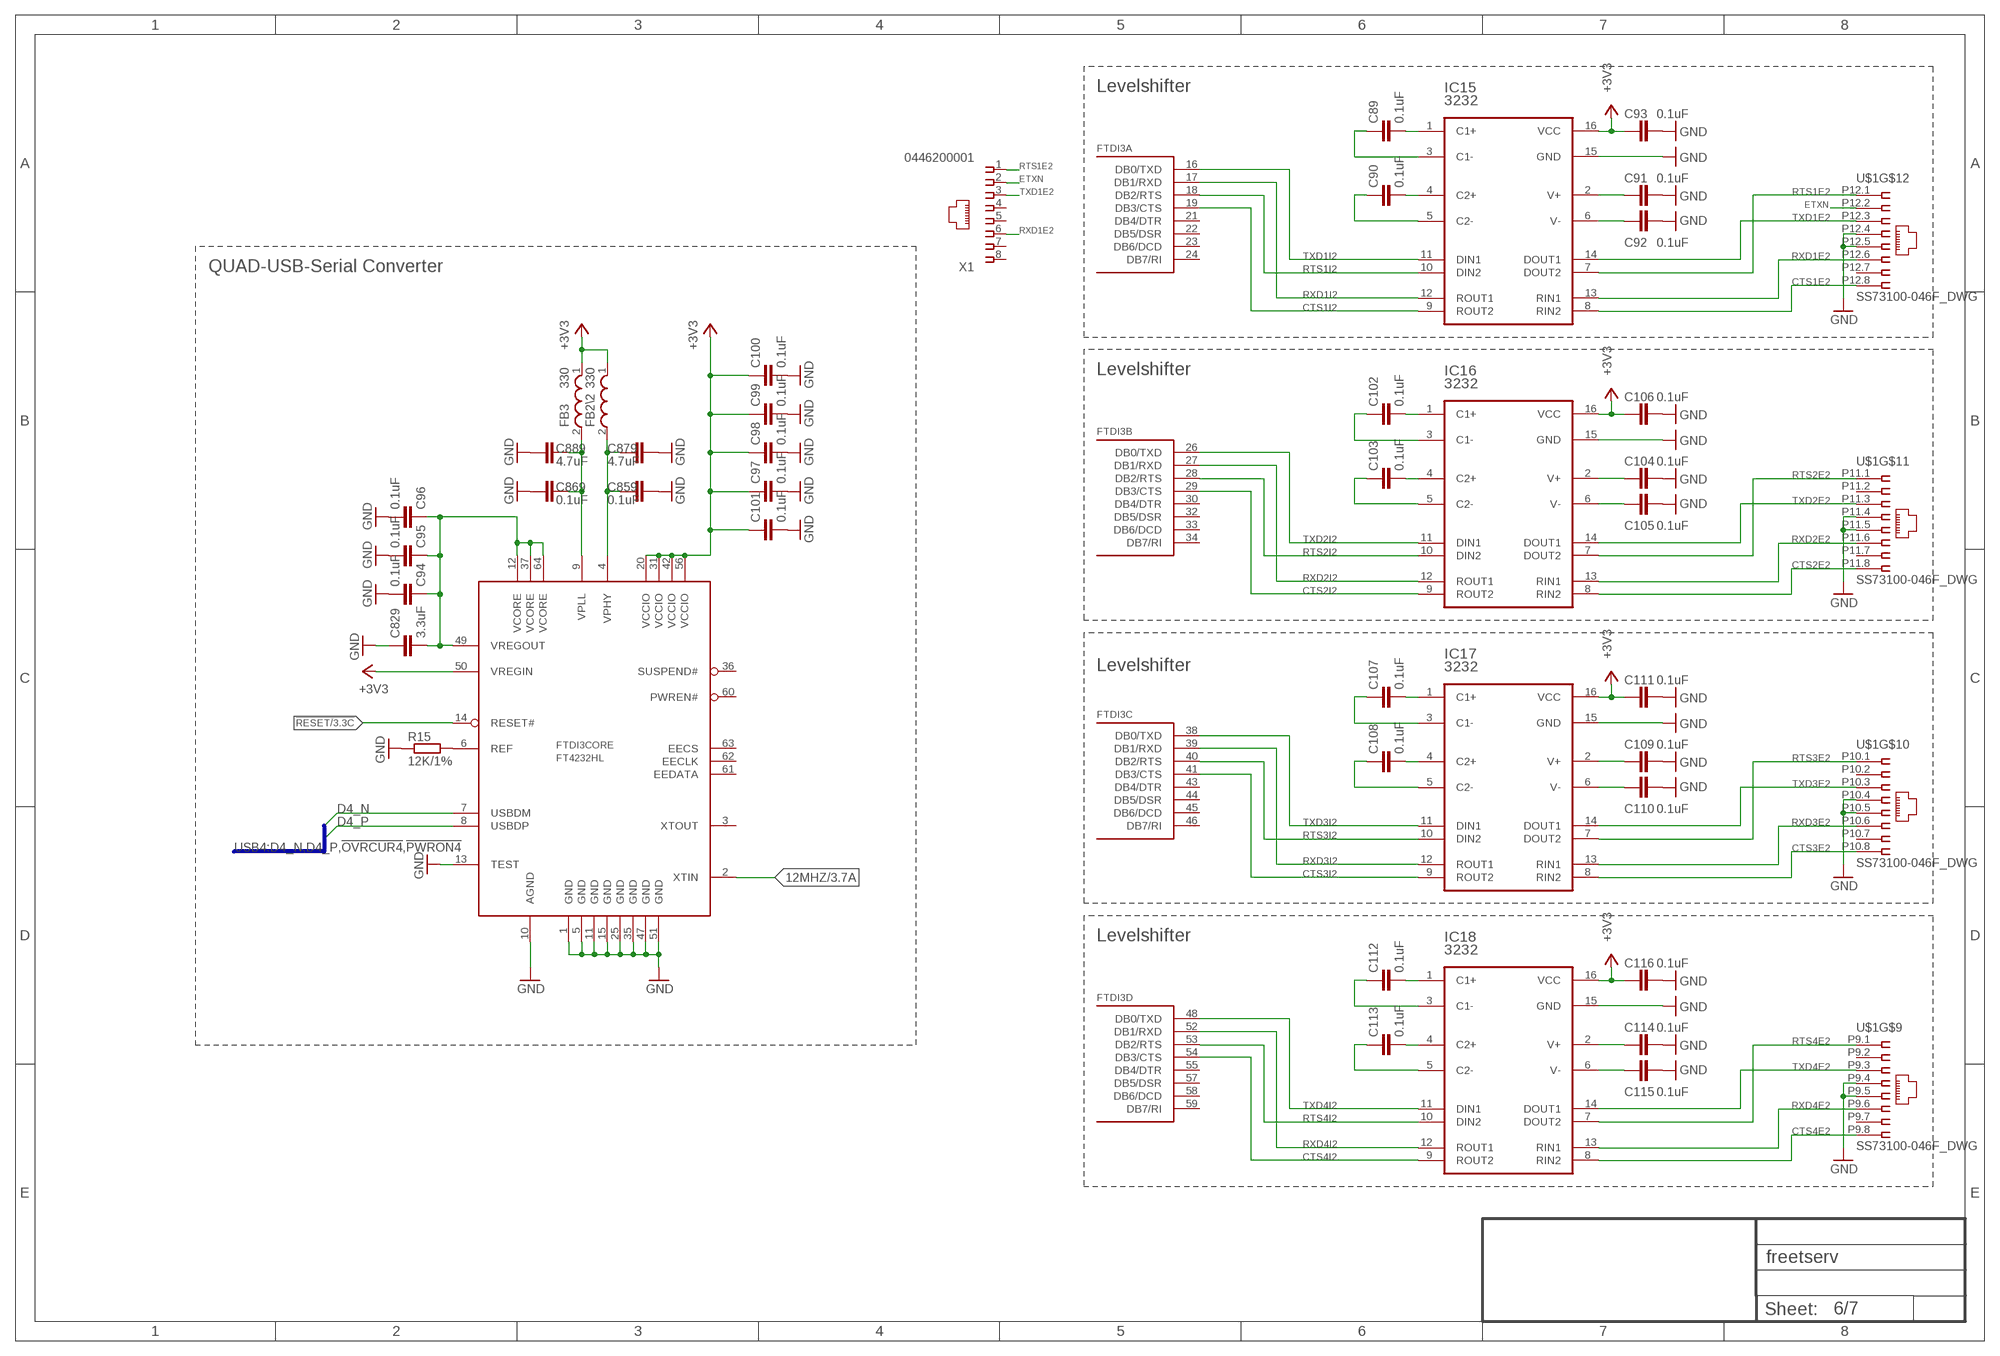
[diagram p5: schematic, sheet 6]

### Parts
C89  0.1uF  C-EUC0805  [C0805]
C90  0.1uF  C-EUC0805  [C0805]
C91  0.1uF  C-EUC0805  [C0805]
C92  0.1uF  C-EUC0805  [C0805]
C93  0.1uF  C-EUC0805  [C0805]
C94  0.1uF  C-EUC0805  [C0805]
C95  0.1uF  C-EUC0805  [C0805]
C96  0.1uF  C-EUC0805  [C0805]
C97  0.1uF  C-EUC0805  [C0805]
C98  0.1uF  C-EUC0805  [C0805]
C99  0.1uF  C-EUC0805  [C0805]
C100  0.1uF  C-EUC0805  [C0805]
C101  0.1uF  C-EUC0805  [C0805]
C102  0.1uF  C-EUC0805  [C0805]
C103  0.1uF  C-EUC0805  [C0805]
C104  0.1uF  C-EUC0805  [C0805]
C105  0.1uF  C-EUC0805  [C0805]
C106  0.1uF  C-EUC0805  [C0805]
C107  0.1uF  C-EUC0805  [C0805]
C108  0.1uF  C-EUC0805  [C0805]
C109  0.1uF  C-EUC0805  [C0805]
C110  0.1uF  C-EUC0805  [C0805]
C111  0.1uF  C-EUC0805  [C0805]
C112  0.1uF  C-EUC0805  [C0805]
C113  0.1uF  C-EUC0805  [C0805]
C114  0.1uF  C-EUC0805  [C0805]
C115  0.1uF  C-EUC0805  [C0805]
C116  0.1uF  C-EUC0805  [C0805]
C829  3.3uF  C-EUC0805  [C0805]
C859  0.1uF  C-EUC0805  [C0805]
C869  0.1uF  C-EUC0805  [C0805]
C879  4.7uF  C-EUC0805  [C0805]
C889  4.7uF  C-EUC0805  [C0805]
FB2\2  330  WE-KI_0805A  [WE-KI_0805A]
FB3  330  WE-KI_0805A  [WE-KI_0805A]
FTDI3  FT4232HL  [LQFP64]
IC15  3232  MAX3232ECPW  [SOP65P640X120-16N]
IC16  3232  MAX3232ECPW  [SOP65P640X120-16N]
IC17  3232  MAX3232ECPW  [SOP65P640X120-16N]
IC18  3232  MAX3232ECPW  [SOP65P640X120-16N]
R15  12K/1%  R-EU_R0805  [R0805]
X1  0446200001  [0446200001]

### Nets
12MHZ: FTDI3.2(CORE:XTIN) ; also sheet 3,4,5
!RESET: FTDI3.14(CORE:RESET#) ; also sheet 3,4,5
+1V8-3: C94.1 C95.1 C96.1 C829.2 FTDI3.12(CORE:VCORE) FTDI3.37(CORE:VCORE) FTDI3.49(CORE:VREGOUT) FTDI3.64(CORE:VCORE)
+3V3 [power]: C93.2 C97.1 C98.1 C99.1 C100.1 C101.1 C106.2 C111.2 C116.2 FB2\2.1 FB3.1 FTDI3.20(CORE:VCCIO) FTDI3.31(CORE:VCCIO) FTDI3.42(CORE:VCCIO) FTDI3.50(CORE:VREGIN) FTDI3.56(CORE:VCCIO) IC15.16(VCC) IC16.16(VCC) IC17.16(VCC) IC18.16(VCC) ; also sheet 3,4,5
CTS1E2: IC15.8(RIN2) U$1.P12.8
CTS1I2: FTDI3.19(A:DB3/CTS) IC15.9(ROUT2)
CTS2E2: IC16.8(RIN2) U$1.P11.8
CTS2I2: FTDI3.29(B:DB3/CTS) IC16.9(ROUT2)
CTS3E2: IC17.8(RIN2) U$1.P10.8
CTS3I2: FTDI3.41(C:DB3/CTS) IC17.9(ROUT2)
CTS4E2: IC18.8(RIN2) U$1.P9.8
CTS4I2: FTDI3.54(D:DB3/CTS) IC18.9(ROUT2)
D4_N [USB]: FTDI3.7(CORE:USBDM) ; also sheet 3
D4_P [USB]: FTDI3.8(CORE:USBDP) ; also sheet 3
ETXN: U$1.P12.2 X1.2
GND: C91.1 C92.1 C93.1 C94.2 C95.2 C96.2 C97.2 C98.2 C99.2 C100.2 C101.2 C104.1 C105.1 C106.1 C109.1 C110.1 C111.1 C114.1 C115.1 C116.1 C829.1 C859.2 C869.2 C879.2 C889.2 FTDI3.1(CORE:GND) FTDI3.5(CORE:GND) FTDI3.10(CORE:AGND) FTDI3.11(CORE:GND) FTDI3.13(CORE:TEST) FTDI3.15(CORE:GND) FTDI3.25(CORE:GND) FTDI3.35(CORE:GND) FTDI3.47(CORE:GND) FTDI3.51(CORE:GND) IC15.15(GND) IC16.15(GND) IC17.15(GND) IC18.15(GND) R15.1 U$1.P9.4 U$1.P9.5 U$1.P10.4 U$1.P10.5 U$1.P11.4 U$1.P11.5 U$1.P12.4 U$1.P12.5 ; also sheet 3,4,5
N$64: FTDI3.6(CORE:REF) R15.2
N$69: C859.1 C879.1 FB2\2.2 FTDI3.4(CORE:VPHY)
N$70: C869.1 C889.1 FB3.2 FTDI3.9(CORE:VPLL)
N$71: C89.2 IC15.1(C1+)
N$72: C89.1 IC15.3(C1-)
N$73: C90.2 IC15.4(C2+)
N$74: C90.1 IC15.5(C2-)
N$75: C91.2 IC15.2(V+)
N$76: C92.2 IC15.6(V-)
N$98: C102.2 IC16.1(C1+)
N$99: C102.1 IC16.3(C1-)
N$100: C103.2 IC16.4(C2+)
N$101: C103.1 IC16.5(C2-)
N$102: C104.2 IC16.2(V+)
N$103: C105.2 IC16.6(V-)
N$104: C107.2 IC17.1(C1+)
N$105: C107.1 IC17.3(C1-)
N$106: C108.2 IC17.4(C2+)
N$107: C108.1 IC17.5(C2-)
N$108: C109.2 IC17.2(V+)
N$109: C110.2 IC17.6(V-)
N$110: C112.2 IC18.1(C1+)
N$111: C112.1 IC18.3(C1-)
N$112: C113.2 IC18.4(C2+)
N$113: C113.1 IC18.5(C2-)
N$114: C114.2 IC18.2(V+)
N$115: C115.2 IC18.6(V-)
RTS1E2: IC15.7(DOUT2) U$1.P12.1 X1.1
RTS1I2: FTDI3.18(A:DB2/RTS) IC15.10(DIN2)
RTS2E2: IC16.7(DOUT2) U$1.P11.1
RTS2I2: FTDI3.28(B:DB2/RTS) IC16.10(DIN2)
RTS3E2: IC17.7(DOUT2) U$1.P10.1
RTS3I2: FTDI3.40(C:DB2/RTS) IC17.10(DIN2)
RTS4E2: IC18.7(DOUT2) U$1.P9.1
RTS4I2: FTDI3.53(D:DB2/RTS) IC18.10(DIN2)
RXD1E2: IC15.13(RIN1) U$1.P12.6 X1.6
RXD1I2: FTDI3.17(A:DB1/RXD) IC15.12(ROUT1)
RXD2E2: IC16.13(RIN1) U$1.P11.6
RXD2I2: FTDI3.27(B:DB1/RXD) IC16.12(ROUT1)
RXD3E2: IC17.13(RIN1) U$1.P10.6
RXD3I2: FTDI3.39(C:DB1/RXD) IC17.12(ROUT1)
RXD4E2: IC18.13(RIN1) U$1.P9.6
RXD4I2: FTDI3.52(D:DB1/RXD) IC18.12(ROUT1)
TXD1E2: IC15.14(DOUT1) U$1.P12.3 X1.3
TXD1I2: FTDI3.16(A:DB0/TXD) IC15.11(DIN1)
TXD2E2: IC16.14(DOUT1) U$1.P11.3
TXD2I2: FTDI3.26(B:DB0/TXD) IC16.11(DIN1)
TXD3E2: IC17.14(DOUT1) U$1.P10.3
TXD3I2: FTDI3.38(C:DB0/TXD) IC17.11(DIN1)
TXD4E2: IC18.14(DOUT1) U$1.P9.3
TXD4I2: FTDI3.48(D:DB0/TXD) IC18.11(DIN1)
Unconnected: FTDI3.3(CORE:XTOUT) FTDI3.21(A:DB4/DTR) FTDI3.22(A:DB5/DSR) FTDI3.23(A:DB6/DCD) FTDI3.24(A:DB7/RI) FTDI3.30(B:DB4/DTR) FTDI3.32(B:DB5/DSR) FTDI3.33(B:DB6/DCD) FTDI3.34(B:DB7/RI) FTDI3.36(CORE:SUSPEND#) FTDI3.43(C:DB4/DTR) FTDI3.44(C:DB5/DSR) FTDI3.45(C:DB6/DCD) FTDI3.46(C:DB7/RI) FTDI3.55(D:DB4/DTR) FTDI3.57(D:DB5/DSR) FTDI3.58(D:DB6/DCD) FTDI3.59(D:DB7/RI) FTDI3.60(CORE:PWREN#) FTDI3.61(CORE:EEDATA) FTDI3.62(CORE:EECLK) FTDI3.63(CORE:EECS) U$1.P9.2 U$1.P9.7 U$1.P10.2 U$1.P10.7 U$1.P11.2 U$1.P11.7 U$1.P12.7 X1.4 X1.5 X1.7 X1.8

### Buses
USB4:D4_N,D4_P,!OVRCUR4,!PWRON4

### Notes on the sheet
- Levelshifter
- QUAD-USB-Serial Converter
- Levelshifter
- Levelshifter
- Levelshifter

## Sheet 7 of 7
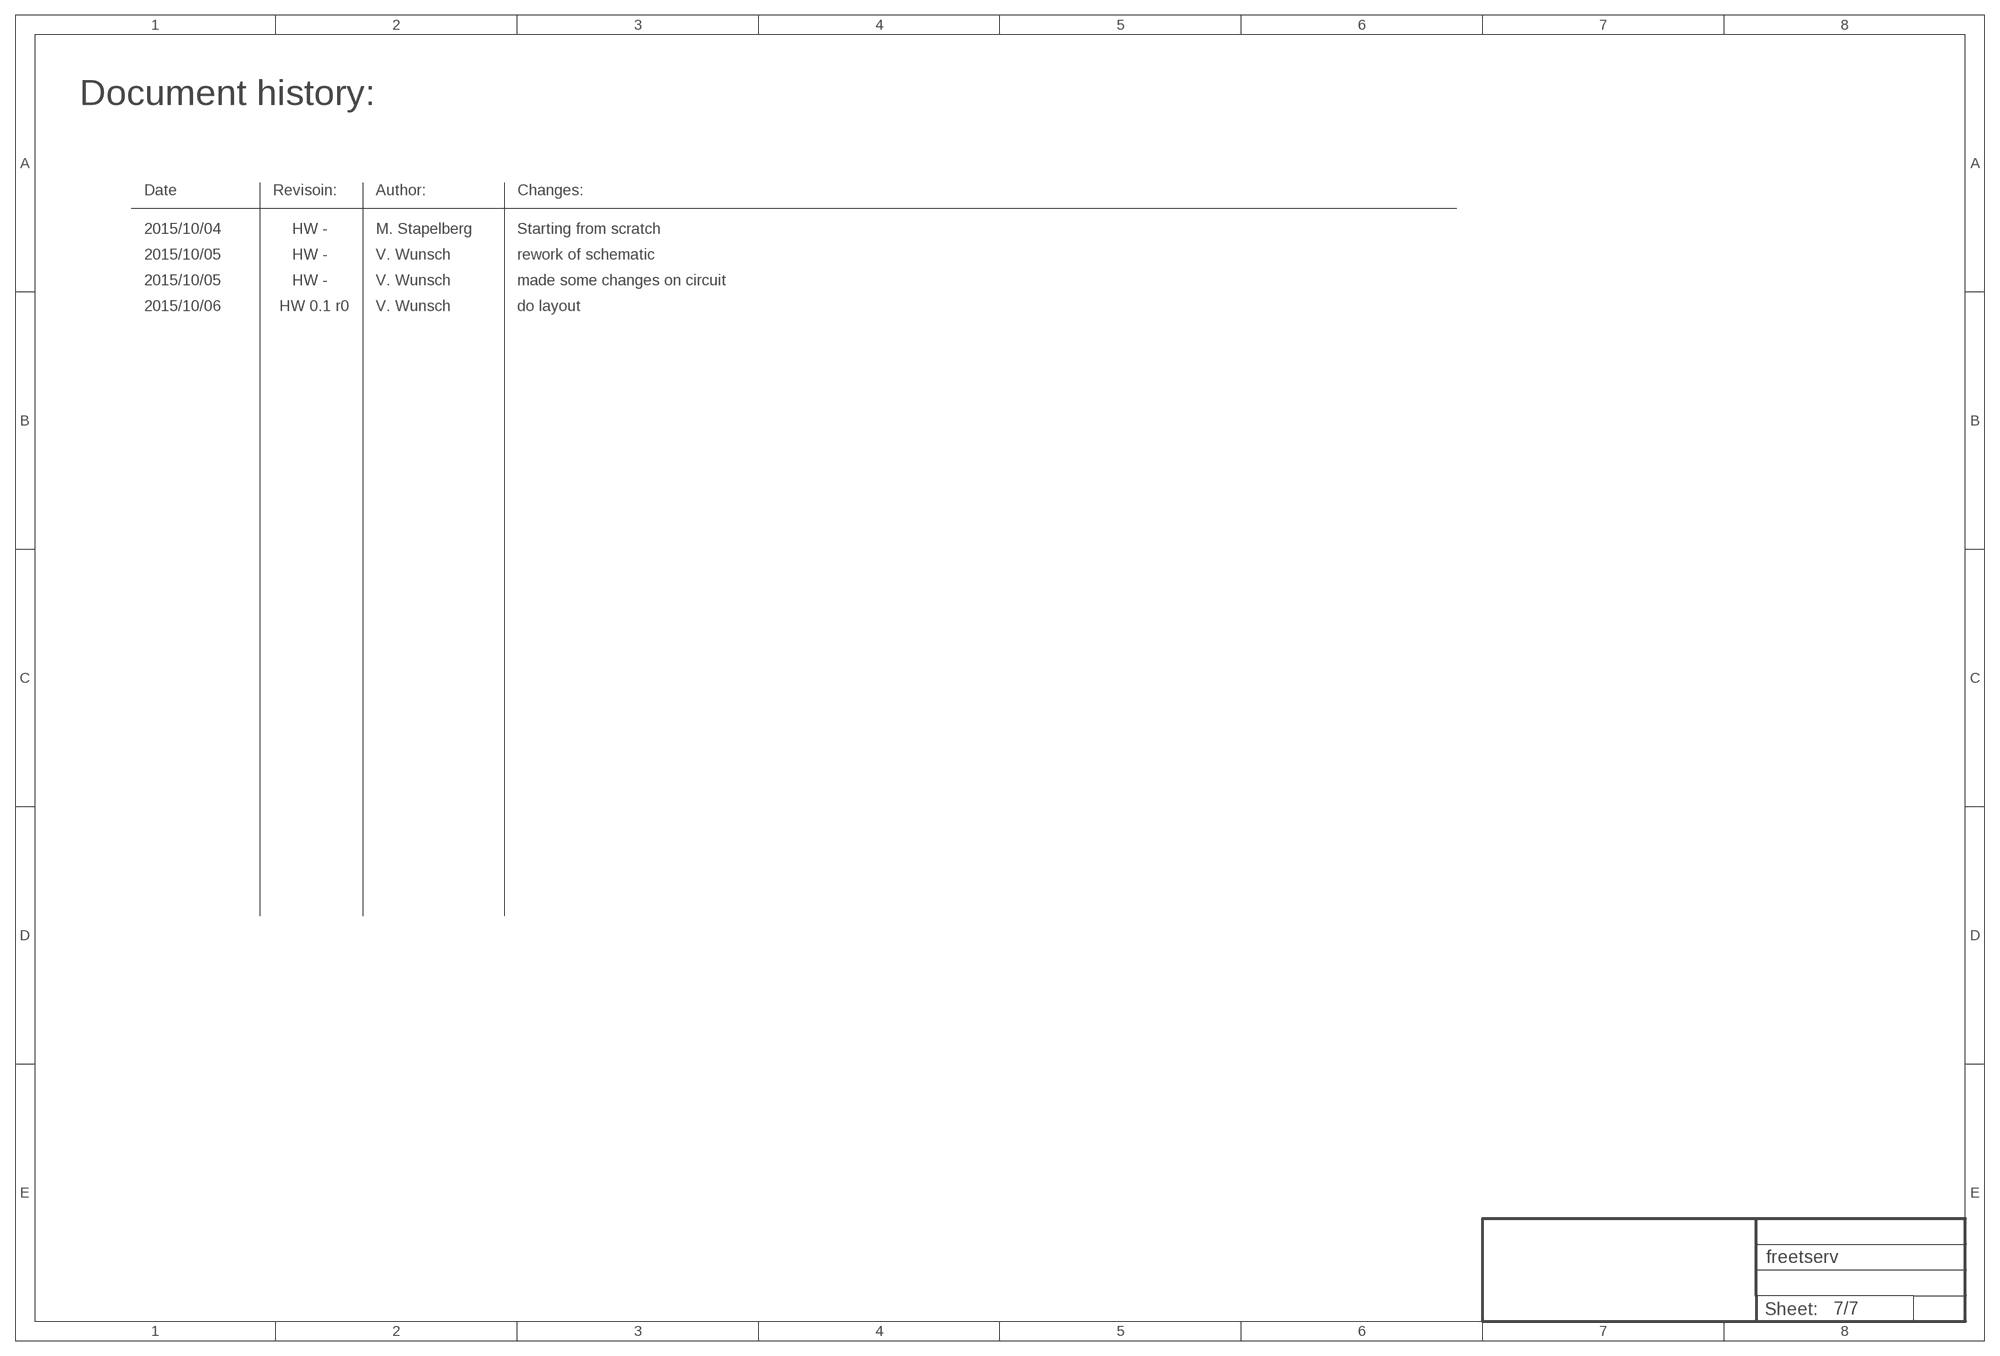
[diagram p6: schematic, sheet 7]

### Notes on the sheet
- Document history:
- Date | Revisoin: | Author: | Changes:
- 2015/10/04 | HW - | M. Stapelberg | Starting from scratch
- 2015/10/05 | HW - | V. Wunsch | rework of schematic
- 2015/10/05 | HW - | V. Wunsch | made some changes on circuit
- 2015/10/06 | HW 0.1 r0 | V. Wunsch | do layout

## Library data of the parts
C1 C4 C11 C12 C15-C19 C22-C47 C54-C81 C89-C116 C489 C519 C859 C869 = resistor:C-EU: CAPACITOR, European symbol; PARTNO: 1276-1003-1-ND
C2 C3 C6 C7 = resistor:C-EU: CAPACITOR, European symbol; PARTNO: 490-10517-1-ND
C5 = resistor:C-EU: CAPACITOR, European symbol; PARTNO: 311-1365-1-ND
C8 C629 C829 = resistor:C-EU: CAPACITOR, European symbol; PARTNO: 445-7589-1-ND
C13 C14 C53 C502 C879 C889 = resistor:C-EU: CAPACITOR, European symbol; PARTNO: 1276-2972-1-ND
C20 C21 = resistor:C-EU: CAPACITOR, European symbol; PARTNO: 709-1171-1-ND
D1 D2 = texas1:SN65220; PARTNO: 296-9694-1-ND
DAISY_IN = Wurth_Elektronik_Electromechanic_Board_to_Board_Connectors_rev15c:613004143121: WR-PHD 2.54mm Angled Socket Header, 4 Pins =>Code : Con_BTB_SHD_2.54_1_THT_613004143121 <http://katalog.we-online.de/media/images/eican/Con_BTB_SHD_2.54_1_THT_6130xx143121_pf2.jpg> Details see: http://katalog.we-online.de/en/em/613_0xx_143_121 Created 2014-05-29, Karrer Zheng 2014 (C) Würth Elektronik; PARTNO: 732-2863-ND
DAISY_OUT = Wurth_Elektronik_Electromechanic_Board_to_Board_Connectors_rev15c:61300411021: WR-PHD 2.54mm Angled Pin Header, 4 Pins =>Con_BTB_PHD_2.54_1_THT_61300411021 <http://katalog.we-online.de/media/images/eican/Con_BTB_PHD_2.54_1_THT_61303211021_pf2.jpg> Details see: http://katalog.we-online.de/en/em/613_0xx_110_21 Created 2014-05-29, Karrer Zheng 2014 (C) Würth Elektronik; PARTNO: 732-5337-ND
FB1 FB2 FB2\ FB2\1 FB2\2 FB3 = Wurth_Elektronik_Passive_rev15d:WE-KI: SMD Wire Wound Ceramic Inductor Characteristics WE-KI series offers you an excellent Q factor and highest possible self resonant frequencies up to 12.5 GHz Inductance tolerances: 5% (2% on request) High thermal stability Operating temperature: –40°C to +125°C Applications Especially developed for high frequency applications RF transceiver/communications Bluetooth Wireless LAN <http://katalog.we-online.de/media/images/eisos/RfKI_pf2.jpg> Details see: http://katalog.we-online.de/en/pbs/WE-KI Updated by Dan Xu 2014-07-08 2014 (C) Wurth Elektronik; PARTNO: 490-5988-1-ND
FTDI1-FTDI3 = ftdichip-6:FT4232H: Quad USB UART 5th generation USB to 4-port serial controller; PARTNO: 768-1026-1-ND
H1 H2 = holes:MOUNT-HOLE: MOUNTING HOLE with drill center marker
HUB = Texas Instruments_By_element14_Batch_1:TUSB2046BVF: THE UNIVERSAL SERIAL BUS; MPN: TUSB2046BVF; OC_FARNELL: 1470507; OC_NEWARK: 77C1805; PACKAGE: LQFP-32; SUPPLIER: TEXAS INSTRUMENTS
IC1 = microchip:MCP16311; PARTNO: MCP16311-E/MS-ND
IC5-IC8 IC10-IC13 IC15-IC18 = Texas Instruments_By_element14_Batch_1:MAX3232ECPW: RS-232 Line Driver/Receiver; MPN: MAX3232ECPW; OC_FARNELL: -; OC_NEWARK: 52K5774; PACKAGE: TSSOP-16; PARTNO: 296-19263-1-ND; SUPPLIER: Texas Instruments
L3 = inductor-taiyoyuden:NR6028; PARTNO: 587-2624-1-ND
PWRIN = pinhead:PINHD-1X2: PIN HEADER; PARTNO: A1921-ND
Q2 = crystal:CSM-7X-DU: SMD CRYSTAL Source: www.ecsxtal.com .. Crystal 3.6864MHz CSM_7X_DU.PDF; OC_FARNELL: unknown; OC_NEWARK: unknown; PARTNO: 535-10208-1-ND
QG1 = crystal:XO-: CRYSTAL; PARTNO: 535-9253-1-ND
R1 R8 = resistor:R-EU_: RESISTOR, European symbol; PARTNO: 311-27ARCT-ND
R2 R13 R15 = resistor:R-EU_: RESISTOR, European symbol; PARTNO: 311-12.0KCRCT-ND
R3 R6 = resistor:R-EU_: RESISTOR, European symbol; PARTNO: 311-1.5KARCT-ND
R4 = resistor:R-EU_: RESISTOR, European symbol; PARTNO: 311-31.6KCRCT-ND
R5 = resistor:R-EU_: RESISTOR, European symbol; PARTNO: 311-10KARCT-ND
R7 = resistor:R-EU_: RESISTOR, European symbol; PARTNO: 311-22KARCT-ND
RN2 = resistor-net:EXBV4V; PARTNO: Y2270CT-ND
U$1 = stewart_ss73100_046f_dwg:SS73100-046F_DWG; PARTNO: 380-1225-ND
USB_HOST = ftdi_ft231xq-r:USB_MICROB: This is the hirose ZX62-B-5PA(11) MICRO-USB B Type female connection.; PARTNO: H11634CT-ND
X1 = con-molex:0446200001: RJ-45 MODULAR JACK ASSEMBLY WITH RJ-11 KEEPOUT FEATURE Source: Data sheet <http://www.farnell.com/datasheets/73207.pdf>; OC_FARNELL: unknown

## Net classes
1 USB: width 0.178 mm, clearance 0.178 mm
2 power: width 0.406 mm